# Altium schematic sheet USB3.0HUB_2.SCHDOC
size A4
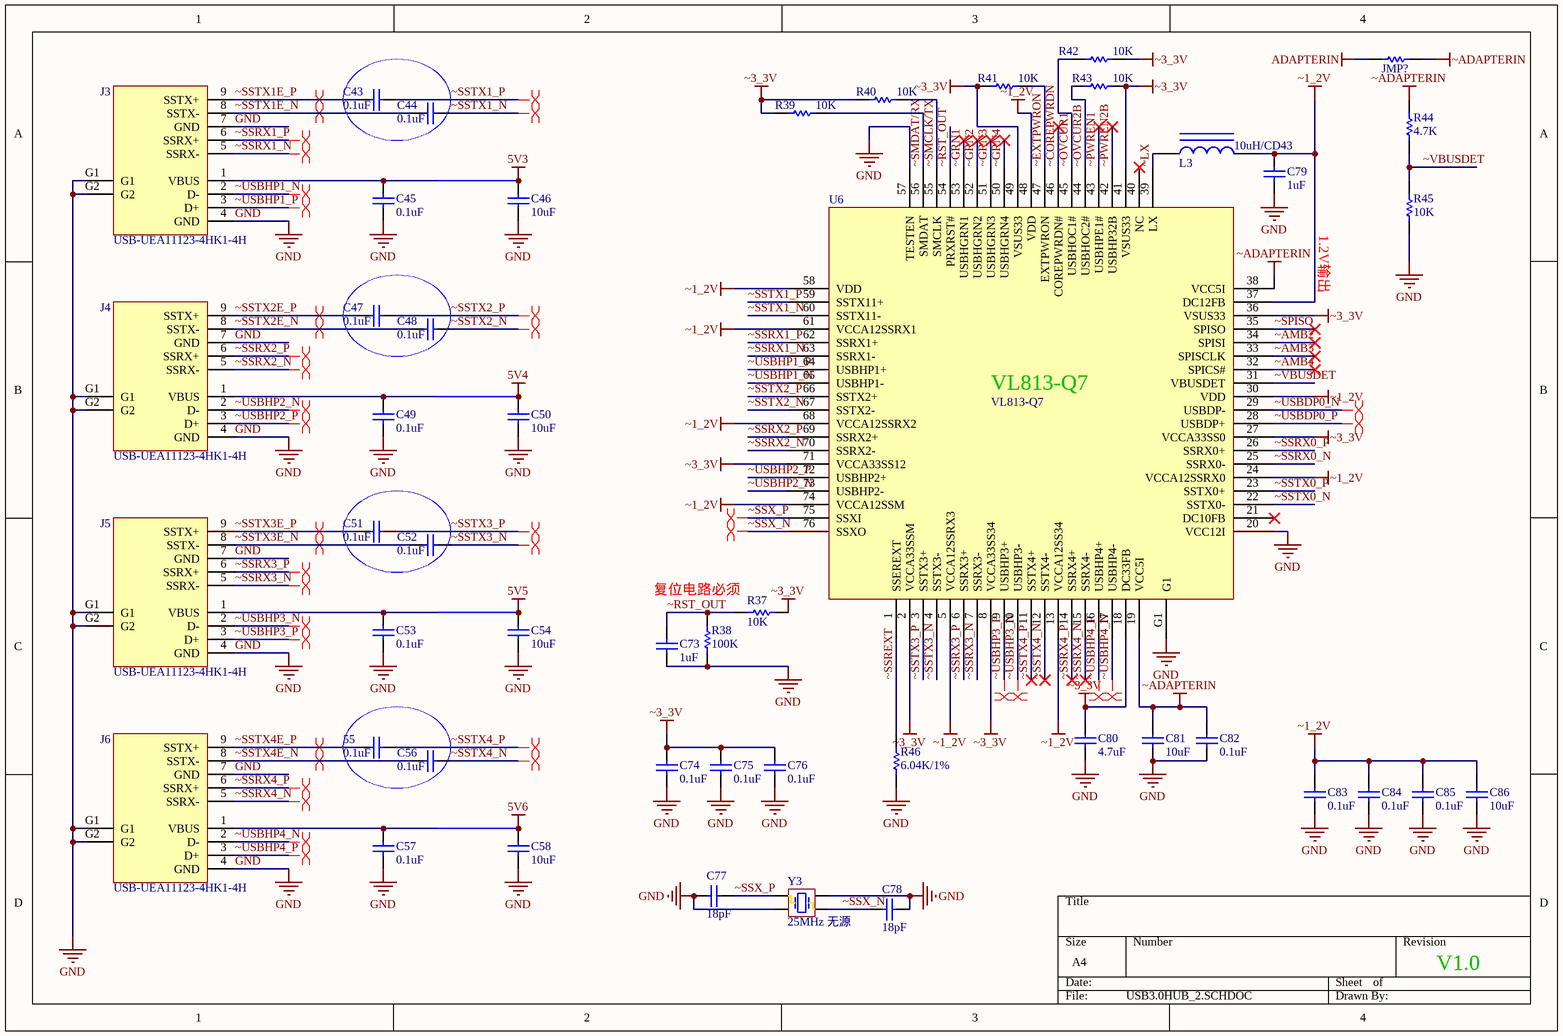
[diagram p0: USB3.0HUB_2.SCHDOC]

## Parts
55  0.1uF  [0603C]
C43  0.1uF  [0603C]
C44  0.1uF  [0603C]
C45  0.1uF  [0603C]
C46  10uF  [0805C]
C47  0.1uF  [0603C]
C48  0.1uF  [0603C]
C49  0.1uF  [0603C]
C50  10uF  [0805C]
C51  0.1uF  [0603C]
C52  0.1uF  [0603C]
C53  0.1uF  [0603C]
C54  10uF  [0805C]
C56  0.1uF  [0603C]
C57  0.1uF  [0603C]
C58  10uF  [0805C]
C73  1uF  [0603C]
C74  0.1uF  [0603C]
C75  0.1uF  [0603C]
C76  0.1uF  [0603C]
C77  18pF  [0603C]
C78  18pF  [0603C]
C79  1uF  [0603C]
C80  4.7uF  [3216]
C81  10uF  [3216]
C82  0.1uF  [0603C]
C83  0.1uF  [0603C]
C84  0.1uF  [0603C]
C85  0.1uF  [0603C]
C86  10uF  [3216]
J3  USB-UEA11123-4HK1-4H  [USB3.0-A]
J4  USB-UEA11123-4HK1-4H  [USB3.0-A]
J5  USB-UEA11123-4HK1-4H  [USB3.0-A]
J6  USB-UEA11123-4HK1-4H  [USB3.0-A]
JMP?  0  [0603R]  (value not drawn)
L3  10uH/CD43  [CD4532]
R37  10K  [0603R]
R38  100K  [0603R]
R39  10K  [0603R]
R40  10K  [0603R]
R41  10K  [0603R]
R42  10K  [0603R]
R43  10K  [0603R]
R44  4.7K  [0603R]
R45  10K  [0603R]
R46  6.04K/1%  [0603R]
U6  VL813-Q7  [QFN76-15P7-TH]
Y3  25MHz 无源  [X3225]

## Nets
5V3: C45.2 C46.1 J3.1(VBUS)
5V4: C49.2 C50.1 J4.1(VBUS)
5V5: C53.2 C54.1 J5.1(VBUS)
5V6: C57.2 C58.1 J6.1(VBUS)
ADAPTERIN: JMP?.2
GND: C45.1 C46.2 C49.1 C50.2 C53.1 C54.2 C57.1 C58.2 C73.2 C74.1 C75.1 C76.1 C77.1 C78.1 C79.1 C80.2 C81.2 C82.1 C83.1 C84.1 C85.1 C86.2 J3.4(GND) J3.7(GND) J3.G1 J3.G2 J4.4(GND) J4.7(GND) J4.G1 J4.G2 J5.4(GND) J5.7(GND) J5.G1 J5.G2 J6.4(GND) J6.7(GND) J6.G1 J6.G2 R38.1 R45.2 R46.2 U6.20(VCC12I) U6.57(TESTEN) U6.G1 Y3.2(NA) Y3.4(NA)
~1_2V: C79.2 C83.2 C84.2 C85.2 C86.1 L3.2 U6.5(VCCA12SSRX3) U6.13(VCCA12SS34) U6.24(VCCA12SSRX0) U6.30(VDD) U6.37(DC12FB) U6.48(VDD) U6.58(VDD) U6.61(VCCA12SSRX1) U6.68(VCCA12SSRX2) U6.74(VCCA12SSM)
~3_3V: C74.2 C75.2 C76.2 C80.1 R37.2 R39.1 R40.1 R41.1 R42.1 R43.1 U6.2(VCCA33SSM) U6.8(VCCA33SS34) U6.18(DC33FB) U6.27(VCCA33SS0) U6.36(VSUS33) U6.41(VSUS33) U6.49(VSUS33) U6.71(VCCA33SS12)
~ADAPTERIN: C81.1 C82.2 JMP?.1 R44.1 U6.19(VCC5I) U6.38(VCC5I)
~AMB2: U6.34(SPISI)
~AMB3: U6.33(SPISCLK)
~AMB4: U6.32(SPICS#)
~COREPWRDN: U6.46(COREPWRDN#)
~EXTPWRON: R41.2 U6.47(EXTPWRON)
~GRN1: U6.53(USBHGRN1)
~GRN2: U6.52(USBHGRN2)
~GRN3: U6.51(USBHGRN3)
~GRN4: U6.50(USBHGRN4)
~LX: L3.1 U6.39(LX)
~OVCUR1: R42.2 U6.45(USBHOC1#)
~OVCUR2B: R43.2 U6.44(USBHOC2#)
~PWREN1: U6.43(USBHPE1#)
~PWREN2B: U6.42(USBHP32B)
~RST_OUT: C73.1 R37.1 R38.2 U6.54(PRXRST#)
~SMCLK/TX: R40.2 U6.55(SMCLK)
~SMDAT/RX: R39.2 U6.56(SMDAT)
~SPISO: U6.35(SPISO)
~SSREXT: R46.1 U6.1(SSEREXT)
~SSRX0_N: U6.25(SSRX0-)
~SSRX0_P: U6.26(SSRX0+)
~SSRX1_N: J3.5(SSRX-) U6.63(SSRX1-)
~SSRX1_P: J3.6(SSRX+) U6.62(SSRX1+)
~SSRX2_N: J4.5(SSRX-) U6.70(SSRX2-)
~SSRX2_P: J4.6(SSRX+) U6.69(SSRX2+)
~SSRX3_N: J5.5(SSRX-) U6.7(SSRX3-)
~SSRX3_P: J5.6(SSRX+) U6.6(SSRX3+)
~SSRX4_N: J6.5(SSRX-) U6.15(SSRX4-)
~SSRX4_P: J6.6(SSRX+) U6.14(SSRX4+)
~SSTX0_N: U6.22(SSTX0-)
~SSTX0_P: U6.23(SSTX0+)
~SSTX1_N: C44.1 U6.60(SSTX11-)
~SSTX1_P: C43.1 U6.59(SSTX11+)
~SSTX1E_N: C44.2 J3.8(SSTX-)
~SSTX1E_P: C43.2 J3.9(SSTX+)
~SSTX2_N: C48.1 U6.67(SSTX2-)
~SSTX2_P: C47.1 U6.66(SSTX2+)
~SSTX2E_N: C48.2 J4.8(SSTX-)
~SSTX2E_P: C47.2 J4.9(SSTX+)
~SSTX3_N: C52.1 U6.4(SSTX3-)
~SSTX3_P: C51.1 U6.3(SSTX3+)
~SSTX3E_N: C52.2 J5.8(SSTX-)
~SSTX3E_P: C51.2 J5.9(SSTX+)
~SSTX4_N: C56.1 U6.12(SSTX4-)
~SSTX4_P: 55.1 U6.11(SSTX4+)
~SSTX4E_N: C56.2 J6.8(SSTX-)
~SSTX4E_P: 55.2 J6.9(SSTX+)
~SSX_N: C78.2 U6.76(SSXO) Y3.3(OSC2)
~SSX_P: C77.2 U6.75(SSXI) Y3.1(OSC1)
~USBDP0_N: U6.29(USBDP-)
~USBDP0_P: U6.28(USBDP+)
~USBHP1_N: J3.2(D-) U6.65(USBHP1-)
~USBHP1_P: J3.3(D+) U6.64(USBHP1+)
~USBHP2_N: J4.2(D-) U6.73(USBHP2-)
~USBHP2_P: J4.3(D+) U6.72(USBHP2+)
~USBHP3_N: J5.2(D-) U6.10(USBHP3-)
~USBHP3_P: J5.3(D+) U6.9(USBHP3+)
~USBHP4_N: J6.2(D-) U6.17(USBHP4-)
~USBHP4_P: J6.3(D+) U6.16(USBHP4+)
~VBUSDET: R44.2 R45.1 U6.31(VBUSDET)

Not connected (* = marked no-connect by the designer): U6 21(DC10FB)* 40(NC)*

## Layout directives
differential pair: ~SSRX1_N, ~SSRX1_P, ~SSRX2_N, ~SSRX2_P, ~SSRX3_N, ~SSRX3_P, ~SSRX4_N, ~SSRX4_P, ~SSTX1_N, ~SSTX1_P, ~SSTX1E_N, ~SSTX1E_P, ~SSTX2_N, ~SSTX2_P, ~SSTX2E_N, ~SSTX2E_P, ~SSTX3_N, ~SSTX3_P, ~SSTX3E_N, ~SSTX3E_P, ~SSTX4_N, ~SSTX4_P, ~SSTX4E_N, ~SSTX4E_P, ~SSX_N, ~SSX_P, ~USBDP0_N, ~USBDP0_P, ~USBHP1_N, ~USBHP1_P, ~USBHP2_N, ~USBHP2_P, ~USBHP3_N, ~USBHP3_P, ~USBHP4_N, ~USBHP4_P

## Notes on the sheet
- 1.2V输出
- 复位电路必须
- Labels drawn without touching a wire or pin: V1.0, VL813-Q7

## Library data of the parts
55 C43-C54 C56-C58 C73-C86 = Cap: Capacitor; Published: 8-Jun-2000; LatestRevisionDate: 17-Jul-2002; LatestRevisionNote: Re-released for DXP Platform.; PackageReference: RAD-0.3; Publisher: Altium Limited
  55 C43-C45 C47-C49 C51-C53 C56 C57 C74-C76 C82-C85: Value: 0.1uF
  C46 C50 C54 C58 C81 C86: Value: 10uF
  C73 C79: Value: 1uF
  C77 C78: Value: 18pF
  C80: Value: 4.7uF
J3-J6 = USB_DSP
JMP? = Res: Published: 8-Jun-2000; LatestRevisionDate: 17-Jul-2002; LatestRevisionNote: Re-released for DXP Platform.; PackageReference: AXIAL-0.3; Publisher: Altium Limited; Value: 0
L3 = INDUCTOR IRON
R37-R46 = Res: 贴片电阻; Published: 8-Jun-2000; LatestRevisionDate: 17-Jul-2002; LatestRevisionNote: Re-released for DXP Platform.; PackageReference: AXIAL-0.3; Publisher: Altium Limited
  R37 R39-R43 R45: Value: 10K
  R38: Value: 100K
  R44: Value: 4.7K
  R46: Value: 6.04K/1%
U6 = VL812-Q7
Y3 = XTAL_1: Crystal Oscillator; Published: 8-Jun-2000; LatestRevisionDate: 17-Jul-2002; LatestRevisionNote: Re-released for DXP Platform.; PackageReference: R38; Publisher: Altium Limited; Value: 25MHz 无源